# Altium schematic sheet atxmega.SchDoc
size A
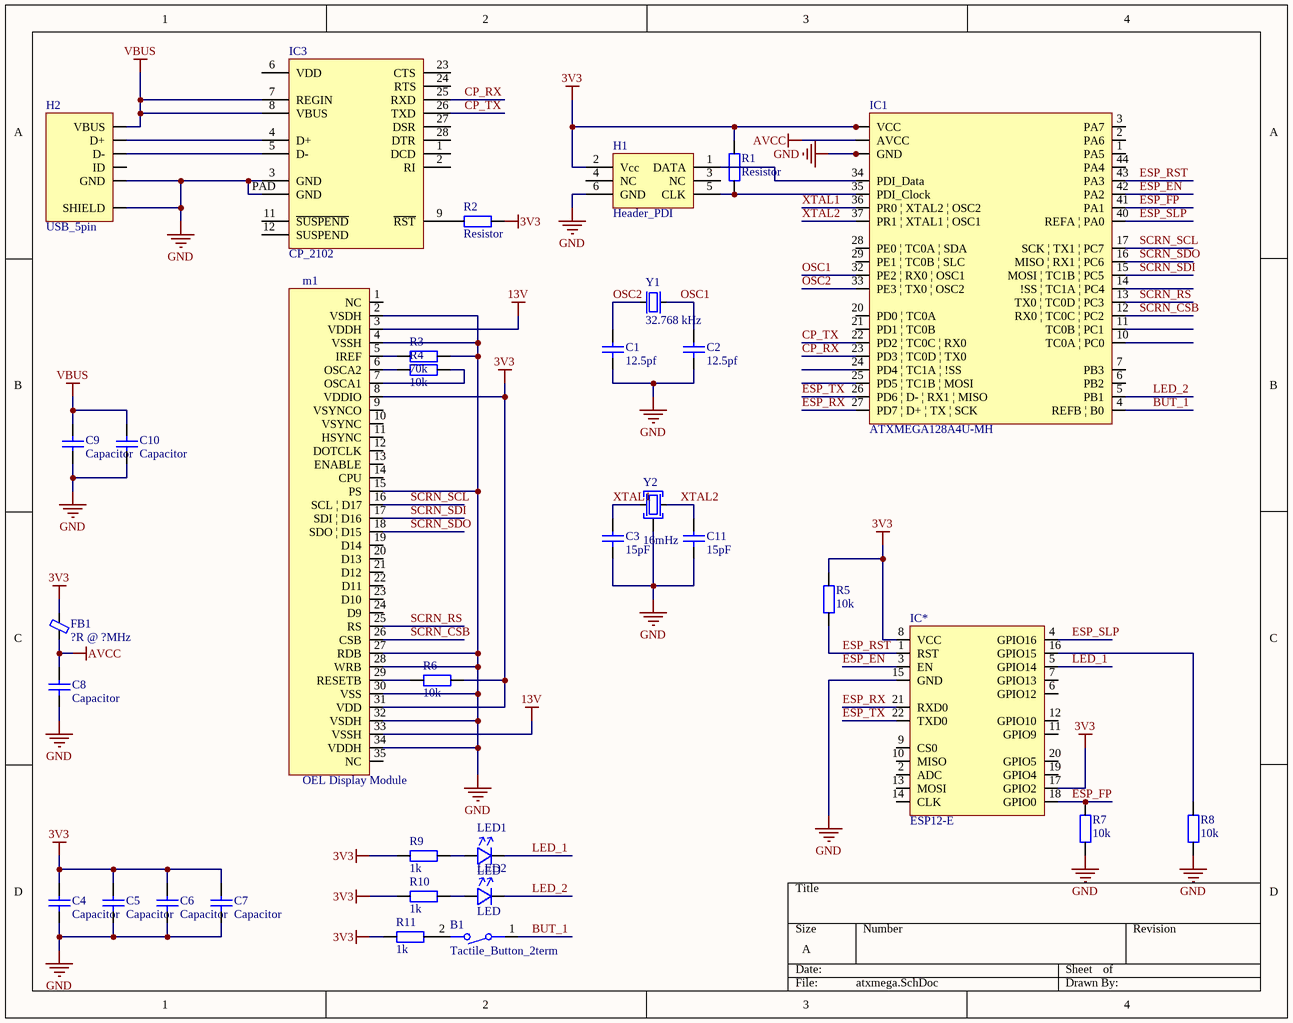
[diagram p0: atxmega.SchDoc]

## Parts
B1  Tactile_Button_2term  [TACTILE_MINATUE_SMD_3.5x6mm]
C1  12.5pf  [C0805]
C2  12.5pf  [C0805]
C3  15pF  [C0805]
C4  Capacitor  [C0402]
C5  Capacitor  [C0402]
C6  Capacitor  [C0402]
C7  Capacitor  [C0402]
C8  Capacitor  [C0402]
C9  Capacitor  [C0402]
C10  Capacitor  [C0402]
C11  15pF  [C0805]
FB1  ?R @ ?MHz  [L0805]
H1  Header_PDI  [6-HEADER_BOXED]
H2  USB_5pin  [USB_Micro_B_RECEPTABLE_FCI]
IC1  ATXMEGA128A4U-MH  [44-VFQFN-E]
IC3  CP_2102  [28-QFN_Exposed_pad]
IC*  ESP12-E  [ESP12-E]
LED1  LED  [0805_LED]
LED2  LED  [0805_LED]
m1  OEL Display Module  [FFC-35-pin-0.5]
R1  Resistor  [R0402]
R2  Resistor  [R0402]
R3  70k  [R0603]
R4  10k  [R0603]
R5  10k  [R0603]
R6  10k  [R0603]
R7  10k  [R0603]
R8  10k  [R0603]
R9  1k  [R0603]
R10  1k  [R0603]
R11  1k  [R0603]
Y1  32.768 kHz  [4-SMD_FORK_CRYSTAL]
Y2  16mHz  [Crystal_2.0x1.6]

## Nets
3V3: C4.1 C5.1 C6.1 C7.1 FB1.2 H1.2(Vcc) IC1.9(VCC) IC1.19(VCC) IC1.31(VCC) IC*.8(VCC) IC*.17(GPIO2) m1.8(VDDIO) m1.31(VDD) R1.1 R2.1 R5.1 R6.1 R9.1 R10.1 R11.1
13V: m1.3(VDDH) m1.33(VSSH)
AVCC: C8.1 FB1.1 IC1.39(AVCC)
GND: C1.2 C2.2 C3.2 C4.2 C5.2 C6.2 C7.2 C8.2 C9.1 C10.1 C11.2 H1.6(GND) H2.5(GND) H2.SHIELD IC1.8(GND) IC1.18(GND) IC1.30(GND) IC1.38(GND) IC1.45(GND) IC3.3(GND) IC3.PAD(GND) IC*.15(GND) m1.2(VSDH) m1.4(VSSH) m1.15(PS) m1.27(RDB) m1.28(WRB) m1.30(VSS) m1.32(VSDH) m1.34(VDDH) R3.1 R7.2 R8.2 Y2.2
VBUS: C9.2 C10.2 H2.1(VBUS) IC3.7(REGIN) IC3.8(VBUS)
BUT_1: B1.1 IC1.4(REFB_|_B0)
CP_RX: IC1.23(PD3_|_TC0D_|_TX0) IC3.25(RXD)
CP_TX: IC1.22(PD2_|_TC0C_|_RX0) IC3.26(TXD)
ESP_EN: IC1.42(PA2) IC*.3(EN)
ESP_FP: IC1.41(PA1) IC*.18(GPIO0) R7.1
ESP_RST: IC1.43(PA3) IC*.1(RST) R5.2
ESP_RX: IC1.27(PD7_|_D+_|_TX_|_SCK) IC*.21(RXD0)
ESP_SLP: IC1.40(REFA_|_PA0) IC*.4(GPIO16)
ESP_TX: IC1.26(PD6_|_D-_|_RX1_|_MISO) IC*.22(TXD0)
LED_1: IC*.5(GPIO14) LED1.C(Cathode)
LED_2: IC1.5(PB1) LED2.C(Cathode)
OSC1: C2.1 IC1.32(PE2_|_RX0_|_OSC1) Y1.1
OSC2: C1.1 IC1.33(PE3_|_TX0_|_OSC2) Y1.2
SCRN_CSB: IC1.12(RX0_|_TC0C_|_PC2) m1.26(CSB)
SCRN_RS: IC1.13(TX0_|_TC0D_|_PC3) m1.25(RS)
SCRN_SCL: IC1.17(SCK_|_TX1_|_PC7) m1.16(SCL_|_D17)
SCRN_SDI: IC1.15(MOSI_|_TC1B_|_PC5) m1.17(SDI_|_D16)
SCRN_SDO: IC1.16(MISO_|_RX1_|_PC6) m1.18(SDO_|_D15)
XTAL1: C3.1 IC1.36(PR0_|_XTAL2_|_OSC2) Y2.1
XTAL2: C11.1 IC1.37(PR1_|_XTAL1_|_OSC1) Y2.3
NetB1_2: B1.2 R11.2
NetH1_1: H1.1(DATA) IC1.34(PDI_Data)
NetH1_5: H1.5(CLK) IC1.35(PDI_Clock) R1.2
NetH2_2: H2.2(D-) IC3.5(D-)
NetH2_3: H2.3(D+) IC3.4(D+)
NetIC3_9: IC3.9(~{RST}) R2.2
NetIC*_16: IC*.16(GPIO15) R8.1
NetLED1_A: LED1.A(Anode) R9.2
NetLED2_A: LED2.A(Anode) R10.2
Netm1_5: m1.5(IREF) R3.2
Netm1_6: m1.6(OSCA2) R4.2
Netm1_7: m1.7(OSCA1) R4.1
Netm1_29: m1.29(RESETB) R6.2

Not connected (* = marked no-connect by the designer): H1 3(NC) 4(NC); H2 4(ID); IC1 1(PA5) 2(PA6) 3(PA7) 6(PB2) 7(PB3) 10(TC0A_|_PC0) 11(TC0B_|_PC1) 14(!SS_|_TC1A_|_PC4) 20(PD0_|_TC0A) 21(PD1_|_TC0B) 24(PD4_|_TC1A_|_!SS) 25(PD5_|_TC1B_|_MOSI) 28(PE0_|_TC0A_|_SDA) 29(PE1_|_TC0B_|_SLC) 44(PA4); IC3 1(DCD) 2(RI) 6(VDD) 11(~{SUSPEND}) 12(SUSPEND) 23(CTS) 24(RTS) 27(DSR) 28(DTR); IC* 2(ADC) 6(GPIO12) 7(GPIO13) 9(CS0) 10(MISO) 11(GPIO9) 12(GPIO10) 13(MOSI) 14(CLK) 19(GPIO4) 20(GPIO5); m1 1(NC) 9(VSYNCO) 10(VSYNC) 11(HSYNC) 12(DOTCLK) 13(ENABLE) 14(CPU) 19(D14) 20(D13) 21(D12) 22(D11) 23(D10) 24(D9) 35(NC)

## Library data of the parts
C1-C11 = Capacitor: Schematic symbol of a capacitor
FB1 = Ferrite
H1 = Header_PDI: 6-pin Boxed header with pinout used for PDI programming by Atmel programmers; Supplier 1: Digi-Key; Supplier Part Number 1: 3M15451-ND
H2 = USB_5pin: 5 Pins USB Connector; Supplier 1: Digi-Key; Supplier 2: Digi-Key; Supplier Part Number 1: 609-4616-1-ND; Supplier Part Number 2: 151-1206-1-ND
IC1 = ATXMEGA128A4U-MH: AVR AVR® XMEGA® A4U Microcontroller IC 8/16-Bit 32MHz 128KB (64K x 16) FLASH 44-VQFN (7x7); Digikey: ATXMEGA128A4U-MH-ND
IC3 = CP_2102: Single chip USB to UART Bridge; Supplier 1: Digi-Key; Supplier Part Number 1: 336-1160-1-ND
LED1 LED2 = LED: Schematic symbol of a LED
m1 = OEL Display Module: Part ID: UG-6028GDEAF01
R1-R11 = Resistor: Schematic symbol of a resistor
Y1 = Crystal: Schematic symbol of a 2pin crystal
Y2 = Crystal_Ground: Schematic symbol of a 2pin crystal with case connection